# Altium schematic sheet TFP403PZP_2023-07-17.schdoc
size 59 x 154 mm
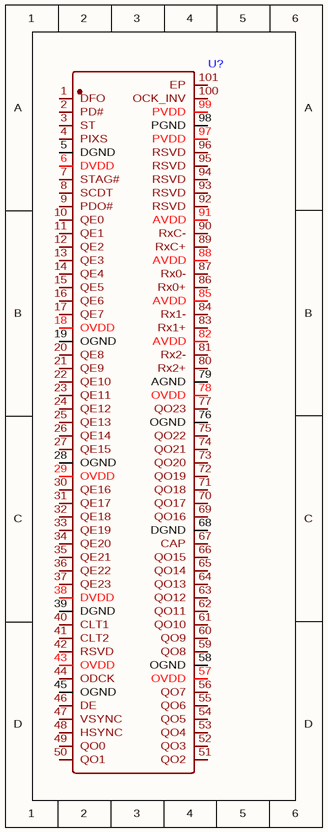
[diagram p0: TFP403PZP_2023-07-17.schdoc]

## Parts
U?  (no value)  [HTQFP-100_L14.0-W14.0-P0.50-LS16.0-BL-EP5.2]

## Nets

Not connected (* = marked no-connect by the designer): U? 1(DFO) 2(PD#) 3(ST) 4(PIXS) 5(DGND) 6(DVDD) 7(STAG#) 8(SCDT) 9(PDO#) 10(QE0) 11(QE1) 12(QE2) 13(QE3) 14(QE4) 15(QE5) 16(QE6) 17(QE7) 18(OVDD) 19(OGND) 20(QE8) 21(QE9) 22(QE10) 23(QE11) 24(QE12) 25(QE13) 26(QE14) 27(QE15) 28(OGND) 29(OVDD) 30(QE16) 31(QE17) 32(QE18) 33(QE19) 34(QE20) 35(QE21) 36(QE22) 37(QE23) 38(DVDD) 39(DGND) 40(CLT1) 41(CLT2) 42(RSVD) 43(OVDD) 44(ODCK) 45(OGND) 46(DE) 47(VSYNC) 48(HSYNC) 49(QO0) 50(QO1) 51(QO2) 52(QO3) 53(QO4) 54(QO5) 55(QO6) 56(QO7) 57(OVDD) 58(OGND) 59(QO8) 60(QO9) 61(QO10) 62(QO11) 63(QO12) 64(QO13) 65(QO14) 66(QO15) 67(CAP) 68(DGND) 69(QO16) 70(QO17) 71(QO18) 72(QO19) 73(QO20) 74(QO21) 75(QO22) 76(OGND) 77(QO23) 78(OVDD) 79(AGND) 80(Rx2+) 81(Rx2-) 82(AVDD) 83(Rx1+) 84(Rx1-) 85(AVDD) 86(Rx0+) 87(Rx0-) 88(AVDD) 89(RxC+) 90(RxC-) 91(AVDD) 92(RSVD) 93(RSVD) 94(RSVD) 95(RSVD) 96(RSVD) 97(PVDD) 98(PGND) 99(PVDD) 100(OCK_INV) 101(EP)

## Library data of the parts
U? = TFP403PZP